# EAGLE design compute hub (EAGLE 8.2.2)
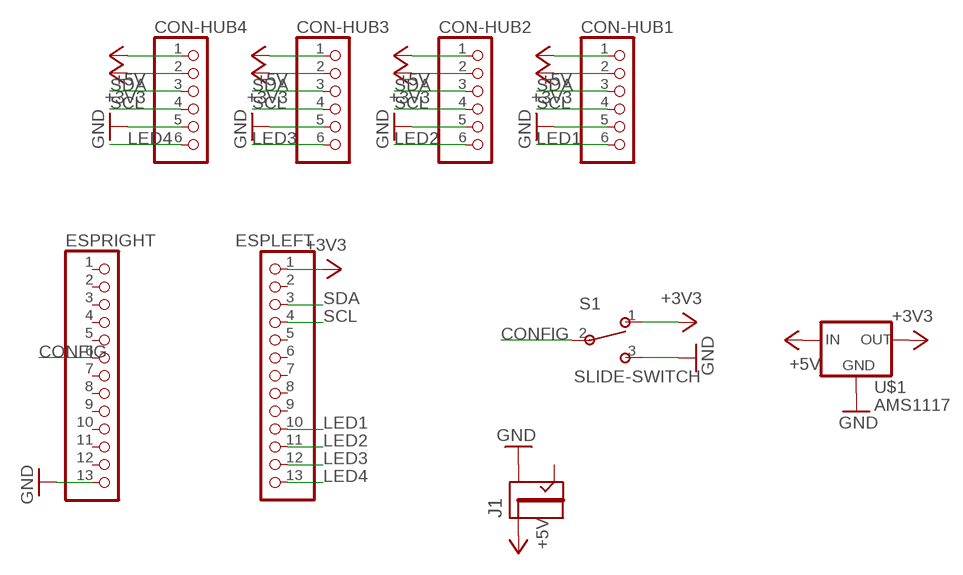
[diagram p0: schematic, sheet 1]

## Parts
CON-HUB1  PINHD-1X6  [1X06]
CON-HUB2  PINHD-1X6  [1X06]
CON-HUB3  PINHD-1X6  [1X06]
CON-HUB4  PINHD-1X6  [1X06]
ESPLEFT  PINHD-1X13  [1X13]
ESPRIGHT  PINHD-1X13  [1X13]
J1  JACK2.1MM  [JACK_2.1MM]
S1  SLIDE-SWITCH  [AYZ0102AGRLC]
U$1  AMS1117  [SOT223]

## Nets
+3V3: CON-HUB1.2 CON-HUB2.2 CON-HUB3.2 CON-HUB4.2 ESPLEFT.1 S1.1 U$1.2(OUT)
+5V: CON-HUB1.1 CON-HUB2.1 CON-HUB3.1 CON-HUB4.1 J1.PIN U$1.3(IN)
CONFIG: ESPRIGHT.6 S1.2
GND: CON-HUB1.5 CON-HUB2.5 CON-HUB3.5 CON-HUB4.5 ESPRIGHT.13 J1.SHUNT S1.3 U$1.1(GND)
LED1: CON-HUB1.6 ESPLEFT.10
LED2: CON-HUB2.6 ESPLEFT.11
LED3: CON-HUB3.6 ESPLEFT.12
LED4: CON-HUB4.6 ESPLEFT.13
SCL: CON-HUB1.4 CON-HUB2.4 CON-HUB3.4 CON-HUB4.4 ESPLEFT.4
SDA: CON-HUB1.3 CON-HUB2.3 CON-HUB3.3 CON-HUB4.3 ESPLEFT.3
Unconnected: ESPLEFT.2 ESPLEFT.5 ESPLEFT.6 ESPLEFT.7 ESPLEFT.8 ESPLEFT.9 ESPRIGHT.1 ESPRIGHT.2 ESPRIGHT.3 ESPRIGHT.4 ESPRIGHT.5 ESPRIGHT.7 ESPRIGHT.8 ESPRIGHT.9 ESPRIGHT.10 ESPRIGHT.11 ESPRIGHT.12 J1.CONTACT

## Library data of the parts
CON-HUB1-CON-HUB4 = pinhead:PINHD-1X6: PIN HEADER
ESPLEFT ESPRIGHT = pinhead:PINHD-1X13: PIN HEADER
J1 = fab:JACK
S1 = fab:SLIDE-SWITCH: SMD slide-switch AYZ0102AGRLC as found in the fablab inventory. Includes the mounting holes. Made by Zaerc.
U$1 = lm1117:AMS1117

## Board
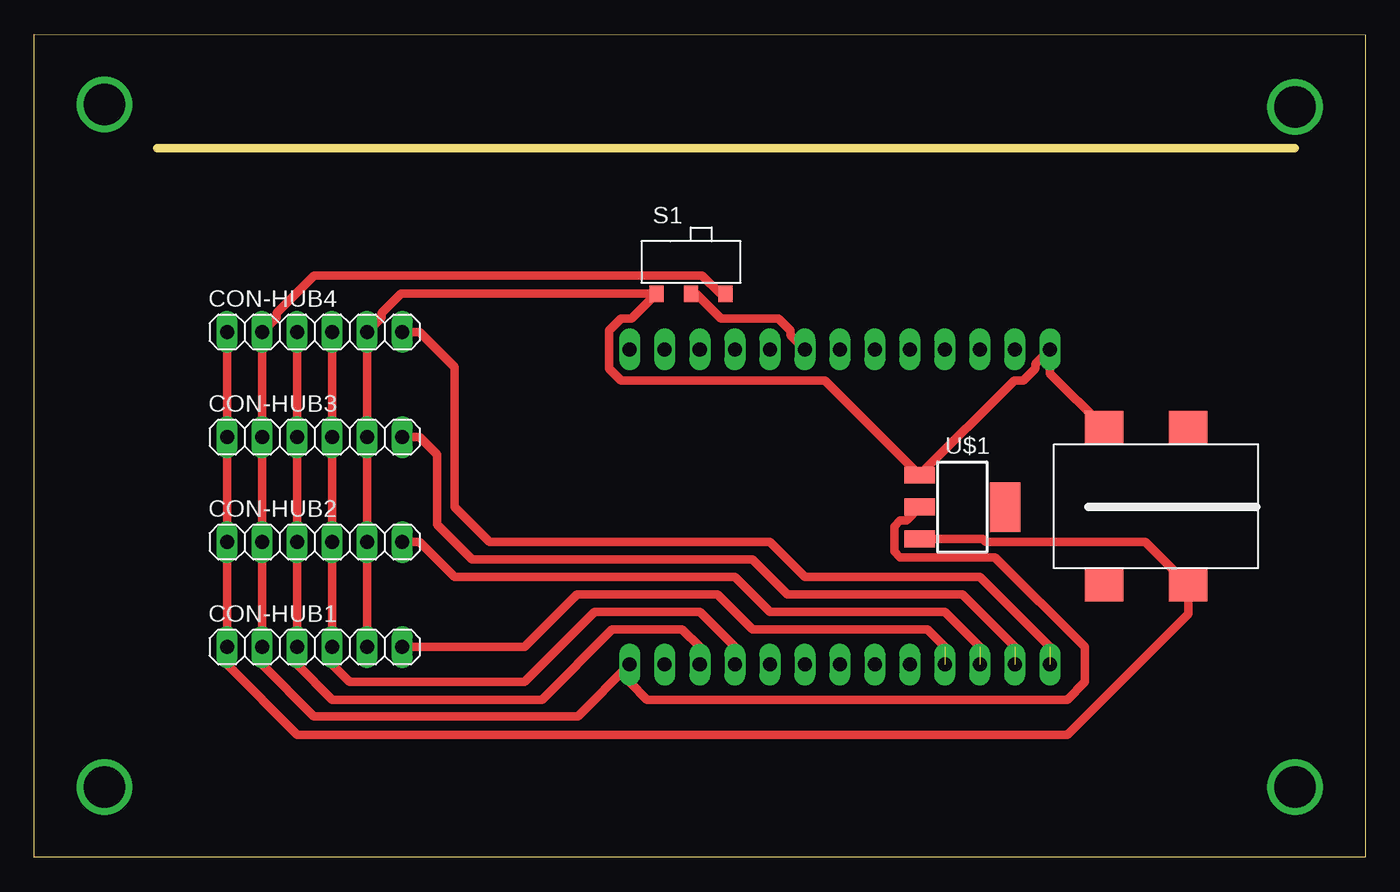
[diagram p1: board, top side]
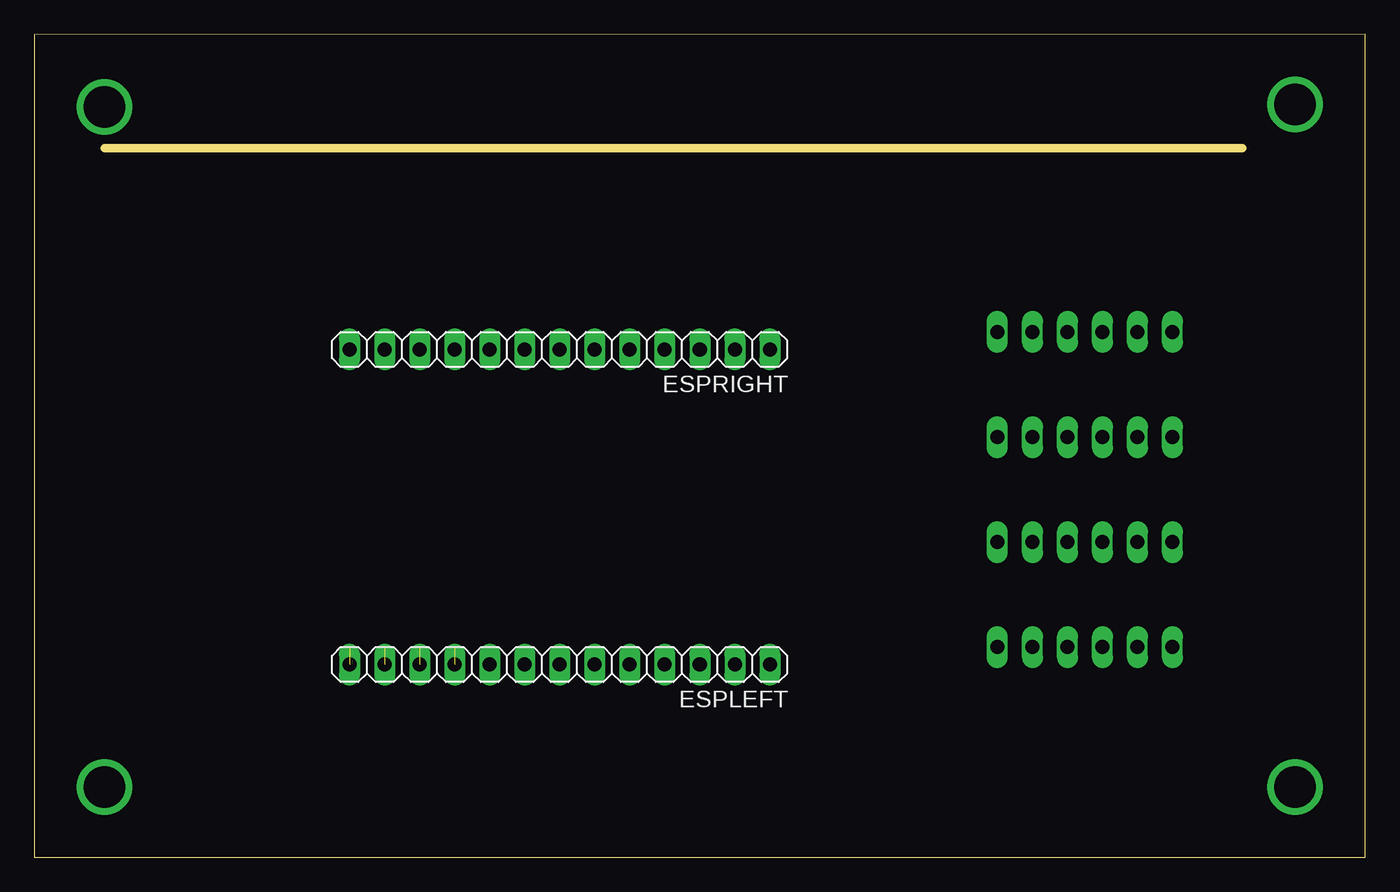
[diagram p2: board, bottom side, seen from below]

Size 96.52 x 59.69 mm. Coordinates in mm from the lower left corner, seen from the top.
Outline: 96.52,0 0,0 0,59.69 96.52,59.68 96.52,0
Copper layers (1*16): Top 0.035mm / dielectric 1.5mm / Bottom 0.035mm
Design rules "fabmodule *": minimum track width 0.6mm, minimum drill 0.4mm, track to track 0.42mm, track to pad 0.42mm, pad to pad 0.42mm, via to via 0.42mm, smd to smd 0.42mm, copper to edge 40mil, drill to drill 0.8mm, minimum pad ring 10mil, minimum via ring 8mil, stop-mask expansion 4mil, vias tented up to drill 0mil, thermal gap 10mil
Milling: 1 lines

### Footprints (pad centres in the part's own frame; a part is rotated, then mirrored left to right if it is on the bottom)
1X06 = drill 1.016 long: 1 -6.35,0; 2 -3.81,0; 3 -1.27,0; 4 1.27,0; 5 3.81,0; 6 6.35,0
1X13 = drill 1.016 long: 1 -15.24,0; 2 -12.7,0; 3 -10.16,0; 4 -7.62,0; 5 -5.08,0; 6 -2.54,0; 7 0,0; 8 2.54,0; 9 5.08,0; 10 7.62,0; 11 10.16,0; 12 12.7,0; 13 15.24,0
JACK_2.1MM = smd 2.388 x 2.794: CONTACT 5.766,-2.413; PIN -5.639,-2.413; PIN1 -5.639,3.683; SHUNT 5.766,3.683
AYZ0102AGRLC = smd 1 x 1.2: 1 2.5,-2.3; 2 0,-2.3; 3 -2.5,-2.3
SOT223 = smd 1.219 x 2.235: 1 -2.311,-3.099; 2 0,-3.099; 3 2.311,-3.099 | smd 3.6 x 2.2: TAB 0,3.099

### Placement (x,y rotation side)
CON-HUB1  20.32,15.24 0 top
CON-HUB2  20.32,22.86 0 top
CON-HUB3  20.32,30.48 0 top
CON-HUB4  20.32,38.1 0 top
ESPLEFT  58.42,13.97 180 bottom
ESPRIGHT  58.42,36.83 180 bottom
J1  81.28,25.4 90 top
S1  47.62,43.18 0 top
U$1  67.31,25.4 270 top

### Tracks (layer width: path | path; a pad name or v marks a point on that pad's centre or on a via)
+3V3
  Top 0.61: S1.1 49.75,40.88 48.43,42.21 20.29,42.21 17.56,39.48 17.56,39.15 CON-HUB4.2 CON-HUB3.2 CON-HUB2.2 CON-HUB1.2 16.51,13.97 20.27,10.21 39.42,10.21 ESPLEFT.1 43.18,12.7 44.45,11.43 74.93,11.43 76.2,12.7 76.2,15.24 69.69,21.75 62.79,21.75 62.37,22.18 62.37,24 62.79,24.42 63.23,24.42 U$1.2
+5V
  Top 0.61: U$1.3 68.8,23.09 69.01,22.88 80.58,22.88 J1.PIN 83.69,17.65 74.93,8.89 19.05,8.89 13.97,13.97 13.97,14.82 CON-HUB1.1 CON-HUB2.1 CON-HUB3.1 CON-HUB4.1
CONFIG
  Top 0.61: ESPRIGHT.6 54.83,37.88 54.83,38.21 53.96,39.08 49.8,39.08 48,40.88 S1.2
GND
  Top 0.61: J1.SHUNT 73.66,35.1 ESPRIGHT.13 72.61,35.78 72.61,35.45 71.74,34.58 71.08,34.58 U$1.1 57.34,34.58 42.56,34.58 41.69,35.45 41.69,38.21 42.56,39.08 43.32,39.08 S1.3 26.59,40.88 25.18,39.48 25.18,39.15 CON-HUB4.5 CON-HUB3.5 CON-HUB2.5 CON-HUB1.5
LED1  (1 unrouted)
  Top 0.61: CON-HUB1.6 35.56,15.24 39.37,19.05 49.53,19.05 52.07,16.51 64.77,16.51 66.04,15.24
LED2  (1 unrouted)
  Top 0.61: 68.58,15.24 66.04,17.78 53.34,17.78 50.8,20.32 30.48,20.32 27.94,22.86 CON-HUB2.6
LED3  (1 unrouted)
  Top 0.61: 71.12,15.24 67.31,19.05 54.61,19.05 52.07,21.59 31.75,21.59 29.21,24.13 29.21,29.21 27.94,30.48 CON-HUB3.6
LED4  (1 unrouted)
  Top 0.61: CON-HUB4.6 27.94,38.1 30.48,35.56 30.48,25.4 33.02,22.86 53.34,22.86 55.88,20.32 68.58,20.32 73.66,15.24
N$1  (via drill 3)
  other vias: 91.44,54.42
N$2  (via drill 3)
  other vias: 5.08,54.61
N$3  (via drill 3)
  other vias: 5.08,5.08
N$4  (via drill 3)
  other vias: 91.44,5.08
SCL
  Top 0.61: ESPLEFT.4 50.8,15.24 48.26,17.78 40.64,17.78 35.56,12.7 22.86,12.7 21.59,13.97 CON-HUB1.4 CON-HUB2.4 CON-HUB3.4 CON-HUB4.4
SDA
  Top 0.61: ESPLEFT.3 48.26,15.24 46.99,16.51 41.91,16.51 36.83,11.43 21.59,11.43 19.05,13.97 CON-HUB1.3 CON-HUB2.3 19.05,29.21 19.05,30.38 CON-HUB3.3 CON-HUB4.3